# EAGLE design dyno_encoders (EAGLE 5.10)
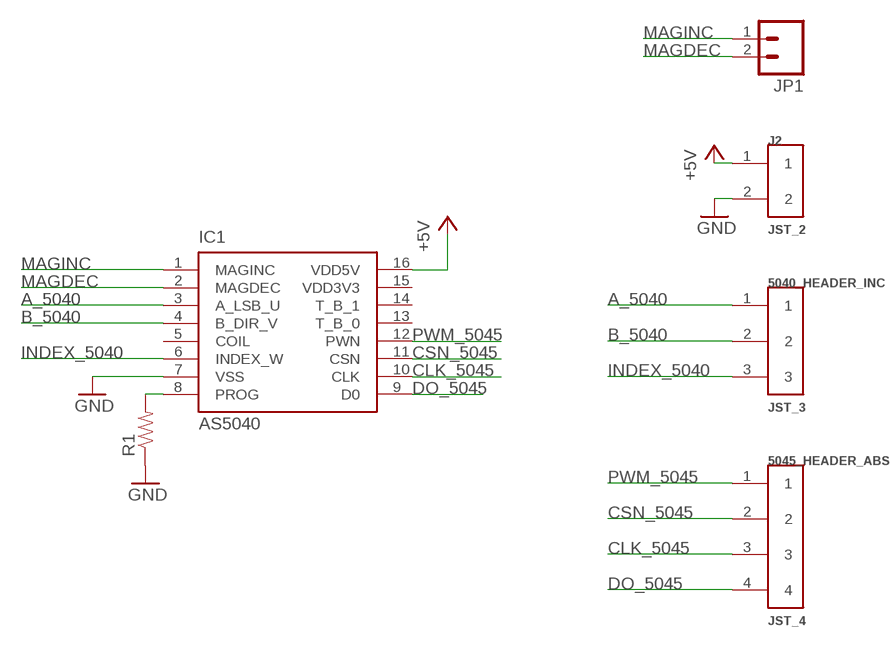
[diagram p0: schematic, sheet 1]

## Parts
5040_HEADER_INC  JST_3  [JST_ZH_3]
5045_HEADER_ABS  JST_4  [JST_ZH_4]
IC1  AS5040  [SSOP16]
J2  JST_2  [JST_ZH_2]
JP1  M02LOCK  [1X02_LOCK]
R1  RESISTOR1206  [1206]

## Nets
+5V: IC1.16(VDD5V) J2.1
A_5040: 5040_HEADER_INC.1 IC1.3(A_LSB_U)
B_5040: 5040_HEADER_INC.2 IC1.4(B_DIR_V)
CLK_5045: 5045_HEADER_ABS.3 IC1.10(CLK)
CSN_5045: 5045_HEADER_ABS.2 IC1.11(CSN)
DO_5045: 5045_HEADER_ABS.4 IC1.9(D0)
GND: IC1.7(VSS) J2.2 R1.1
INDEX_5040: 5040_HEADER_INC.3 IC1.6(INDEX_W)
MAGDEC: IC1.2(MAGDEC) JP1.2
MAGINC: IC1.1(MAGINC) JP1.1
N$2: IC1.8(PROG) R1.2
PWM_5045: 5045_HEADER_ABS.1 IC1.12(PWN)
Unconnected: IC1.5(COIL) IC1.13(T_B_0) IC1.14(T_B_1) IC1.15(VDD3V3)

## Library data of the parts
5040_HEADER_INC = kwoo:JST_3
5045_HEADER_ABS = kwoo:JST_4
IC1 = austriamicrosystems:AS5040: 10-BIT PROGRAMMABLE MAGNETIC ROTARY ENCODER Source: www.austriamicrosystems.com .. AS5040DataSheetRev12.pdf
J2 = kwoo:JST_2
JP1 = SparkFun:M02: Header 2 Standard 2-pin 0.1" header. Use with straight break away headers (SKU : PRT-00116), right angle break away headers (PRT-00553), swiss pins (PRT-00743), machine pins (PRT-00117), and female headers (PRT-00115). Molex polarized connector foot print use with SKU : PRT-08233 with associated crimp pins and housings.
R1 = SparkFun:RESISTOR: Resistor Basic schematic elements and footprints for 0603, 1206, and PTH 1/10th watt (small) resistors.

## Board
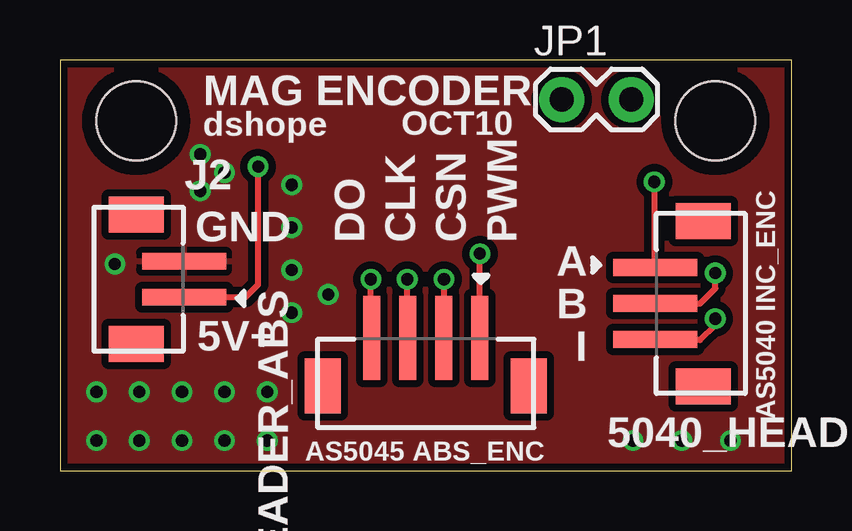
[diagram p1: board, top side]
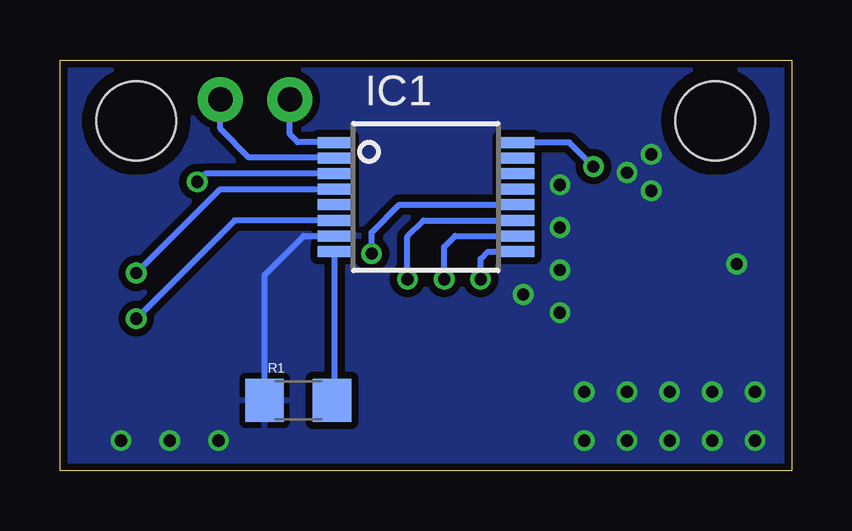
[diagram p2: board, bottom side, seen from below]

Size 30.48 x 17.14 mm. Coordinates in mm from the lower left corner, seen from the top.
Outline: 0,0 30.48,0 30.48,17.14 0,17.14 0,0
Copper layers (1*16): Top 0.035mm / dielectric 1.5mm / Bottom 0.035mm
Design rules "goldphoenix": minimum track width 6mil, minimum drill 15mil, track to track 6mil, track to pad 6mil, pad to pad 6mil, via to via 6mil, smd to smd 6mil, copper to edge 10mil, drill to drill 8mil, minimum pad ring 7mil, minimum via ring 7mil, stop-mask expansion 4mil, vias tented up to drill 0mil, thermal gap 10mil

### Footprints (pad centres in the part's own frame; a part is rotated, then mirrored left to right if it is on the bottom)
JST_ZH_3 = smd 0.7 x 3.5: 1 -1.5,-2; 2 0,-2; 3 1.5,-2 | smd 1.5 x 2.3: CASE1 -3.45,0; CASE2 3.45,0
JST_ZH_4 = smd 0.7 x 3.5: 1 -2.25,-2; 2 -0.75,-2; 3 0.75,-2; 4 2.25,-2 | smd 1.5 x 2.3: CASE1 -4.3,0; CASE2 4.3,0
SSOP16 = smd 0.46 x 1.43: 1 -2.275,-3.795; 2 -1.625,-3.795; 3 -0.975,-3.795; 4 -0.325,-3.795; 5 0.325,-3.795; 6 0.975,-3.795; 7 1.625,-3.795; 8 2.275,-3.795; 9 2.275,3.795; 10 1.625,3.795; 11 0.975,3.795; 12 0.325,3.795; 13 -0.325,3.795; 14 -0.975,3.795; 15 -1.625,3.795; 16 -2.275,3.795
JST_ZH_2 = smd 0.7 x 3.5: 1 -0.75,-2; 2 0.75,-2 | smd 1.5 x 2.3: CASE1 -2.7,0; CASE2 2.7,0
1X02_LOCK = drill 1.016 pad 1.88 round: 1 -0.178,0; 2 2.718,0
1206 = smd 1.6 x 1.8: 1 -1.4,0; 2 1.4,0
STAND-OFF = hole 3.302: 0,0

### Placement (x,y rotation side)
5040_HEADER_INC  26.8,6.99 270 top
5045_HEADER_ABS  15.24,3.56 180 top
IC1  15.24,11.43 270 bottom
J2  3.17,8 90 top
JP1  21.08,15.49 0 top
R1  20.55,2.95 0 bottom
U$1  [STAND-OFF]  27.3,14.61 0 top
U$2  [STAND-OFF]  3.17,14.61 0 top

### Tracks (layer width: path | path; a pad name or v marks a point on that pad's centre or on a via)
+5V  (via drill 0.51)
  Top 0.254: v8.26,12.7 8.26,7.78 7.73,7.25 J2.1
  Bottom 0.254: IC1.16 9.26,13.71 v8.26,12.7
A_5040  (via drill 0.51)
  Top 0.254: v24.77,12.06 24.77,8.52 5040_HEADER_INC.1
  Bottom 0.254: IC1.3 24.43,12.4 v24.77,12.06
B_5040  (via drill 0.51)
  Top 0.254: v27.3,8.26 27.3,7.62 26.67,6.99 5040_HEADER_INC.2
  Bottom 0.254: IC1.4 23.8,11.76 v27.3,8.26
CLK_5045  (via drill 0.51)
  Top 0.254: v14.47,8 14.48,4.55 5045_HEADER_ABS.3
  Bottom 0.254: IC1.10 14.01,9.8 14.47,9.35 v14.47,8.01 v14.47,8
CSN_5045  (via drill 0.51)
  Top 0.254: v16,8 16,4.55 5045_HEADER_ABS.2
  Bottom 0.254: IC1.11 15.33,10.46 16,9.78 v16,8
DO_5045  (via drill 0.51)
  Top 0.254: 12.98,4.54 5045_HEADER_ABS.4 12.95,4.58 v12.95,8
  Bottom 0.254: IC1.9 12.65,9.15 12.95,8.85 v12.95,8
GND  (via drill 0.51)
  Bottom 0.254: IC1.7 20.33,9.8 21.96,8.18 R1.1
  other vias: 1.52,3.3 3.3,3.3 5.08,3.3 1.52,1.27 3.3,1.27 5.08,1.27 6.86,1.27 6.86,3.3 8.64,3.3 8.64,1.27 23.88,1.27 25.91,1.27 27.94,1.27 5.84,13.21 6.86,12.45 5.84,11.68 2.29,8.64 9.65,11.94 9.65,10.16 9.65,8.38 9.65,6.6 11.18,7.37
  pour Top (isolate 0.305): 0,17.53 30.48,17.53 30.48,0 0,0
  pour Bottom (isolate 0.305): 0,18.29 30.48,18.29 30.48,0 0,0
INDEX_5040  (via drill 0.51)
  Top 0.254: v27.3,6.35 27.3,6.1 26.67,5.46 24.82,5.46 5040_HEADER_INC.3
  Bottom 0.254: IC1.6 23.2,10.46 v27.3,6.35
MAGDEC
  Bottom 0.254: JP1.2 23.8,14.28 22.61,13.08 19.06,13.08 IC1.2
MAGINC
  Bottom 0.254: JP1.1 20.9,14.05 20.57,13.72 IC1.1
N$2
  Bottom 0.254: IC1.8 19.04,3.07 R1.2
PWM_5045  (via drill 0.51)
  Top 0.254: v17.5,9.07 5045_HEADER_ABS.1
  Bottom 0.254: IC1.12 16.34,11.11 17.5,9.95 v17.5,9.07

### Text on the board
tPlace: MAG ENCODER | dshope | OCT10 | GND | DO | CLK | CSN | PWM | A | B | I | 5V+ | AS5040 INC_ENC | AS5045 ABS_ENC